# EasyEDA Pro project ax08.eprj, schematic io
Board Name: io; Create Date: 2025-08-28; Page Name: io; Project Name: ax08; Schematic Name: io; Update Date: 2025-08-28; Company: EasyEDA.com; Page Size: A4; Version: V1.0
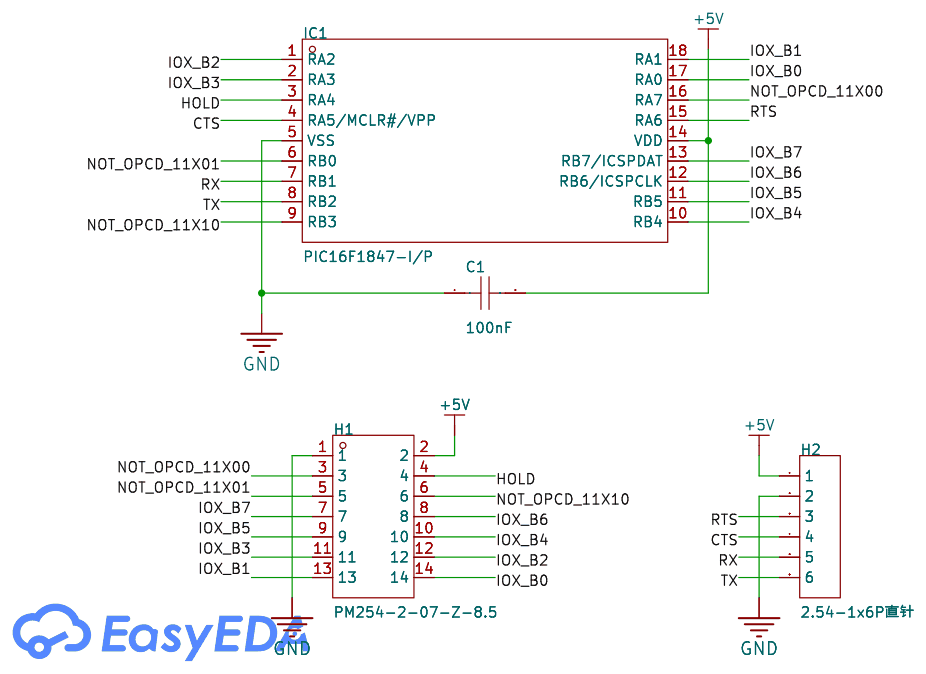
[diagram p20: schematic sheet]

## Parts
C1  100nF  [C0805]
H1  PM254-2-07-Z-8.5  [HDR-TH_14P-P2.54-V-F-R2-C7-S2.54]
H2  2.54-1x6P直针  [HDR-TH_6P-P2.54-V-M-1]
IC1  PIC16F1847-I/P  [PDIP-18_L22.9-W6.4-P2.54-LS7.9-BL]

## Library data of the parts
C1 = CC0805KRX7R9BB104: Capacitance: Tolerance:±10% Tolerance:±10% Voltage Rated: Temperature Coefficient:; LCSC Part Name: 100nF ±10% 50V; Supplier Part: C49678; Manufacturer: YAGEO(国巨); Supplier Footprint: 0805; JLCPCB Part Class: Basic Part; Datasheet: https://atta.szlcsc.com/upload/public/pdf/source/20180224/C181747_15194369449651363981.pdf; Supplier: LCSC; Tolerance: ±10%
H1 = PM254-2-07-Z-8.5: LCSC Part Name: 2x7P 间距:2.54mm 直插; Supplier Part: C2897408; Manufacturer: HCTL(华灿天禄); Supplier Footprint: 插件,P=2.54mm; JLCPCB Part Class: Extended Part; Datasheet: https://atta.szlcsc.com/upload/public/pdf/source/20230609/3D36CA2C1BFC9FD1C3F709AD9DFEB9C2.pdf; Supplier: LCSC; Holes Structure: 2x7P; Pitch: 2.54mm; Row Spacing: 2.54mm; Circular Hole / Square Hole: Square Holes; Mounting Type: Straight; Number of Rows: 双排; Number of Holes: 14P; Current Rating (Max): 3A; Holes Direction: Top; Insulation Height: 8.5mm; Contact Material: Copper Alloy; Operating Temperature Range: -40℃~+105℃; Soldering Temperature(Max): 260℃@5S
H2 = 2.54-1x6P直针: LCSC Part Name: 1x6P 间距:2.54mm 方针 直插; Supplier Part: C37208; Manufacturer: BOOMELE(博穆精密); Supplier Footprint: 插件,P=2.54mm; JLCPCB Part Class: Extended Part; Datasheet: https://atta.szlcsc.com/upload/public/pdf/source/20250115/42A019761A40C8B839643401D8CA5A96.pdf; Supplier: LCSC; Pin Structure: 1x6P; Pitch: 2.54mm; Circluar Pins/Square Pins: Policy; Mounting Type: Straight; Number of Rows: Single Row; Number of Pins: 6P; Current Rating: 3A; Contact Material: Brass; Operating Temperature: -40℃~+105℃; Color: Black
IC1 = PIC16F1847-I/P: CPU Core:PIC Program Storage Size:16KB RAM Size:1KB GPIO Ports Number:15 Operating Voltage Range:1.8V~5.5V Operating Voltage Range:1.8V~5.5V CPU Maximum Speed:32MHz Program Memory Type:FLASH EEPROM:8KB Operating Temperature Range:-40℃~+85℃ Operating Tempe; Supplier Part: C646910; Manufacturer: MICROCHIP(美国微芯); Supplier Footprint: PDIP-18; JLCPCB Part Class: Extended Part; Datasheet: https://atta.szlcsc.com/upload/public/pdf/source/20200624/C624148_F79067E6D18DA6D6E37021FCD51102F9.pdf; Supplier: LCSC; CPU Core: PIC; Program Storage Size: 16KB; RAM Size: 1KB; GPIO Ports Number: 15; Operating Voltage Range: 1.8V~5.5V; CPU Maximum Speed: 32MHz; Program Memory Type: FLASH; EEPROM: 8KB; Operating Temperature Range: -40℃~+85℃; ADC (Bit): 10bit; Peripheral/Function: WDT；PWM; Watchdog: 有; Low-Voltage Detect: 有; Internal Oscillator: 有

## Nets
+5V: C1.2 H1.2 H2.1 IC1.14(VDD)
GND: C1.1 H1.1 H2.2 IC1.5(VSS)
CTS: H2.4 IC1.4(RA5/MCLR#/VPP)
HOLD: H1.4 IC1.3(RA4)
IOX_B0: H1.14 IC1.17(RA0)
IOX_B1: H1.13 IC1.18(RA1)
IOX_B2: H1.12 IC1.1(RA2)
IOX_B3: H1.11 IC1.2(RA3)
IOX_B4: H1.10 IC1.10(RB4)
IOX_B5: H1.9 IC1.11(RB5)
IOX_B6: H1.8 IC1.12(RB6/ICSPCLK)
IOX_B7: H1.7 IC1.13(RB7/ICSPDAT)
NOT_OPCD_11X00: H1.3 IC1.16(RA7)
NOT_OPCD_11X01: H1.5 IC1.6(RB0)
NOT_OPCD_11X10: H1.6 IC1.9(RB3)
RTS: H2.3 IC1.15(RA6)
RX: H2.5 IC1.7(RB1)
TX: H2.6 IC1.8(RB2)
